# Altium schematic sheet PCB.SchDoc
size A4
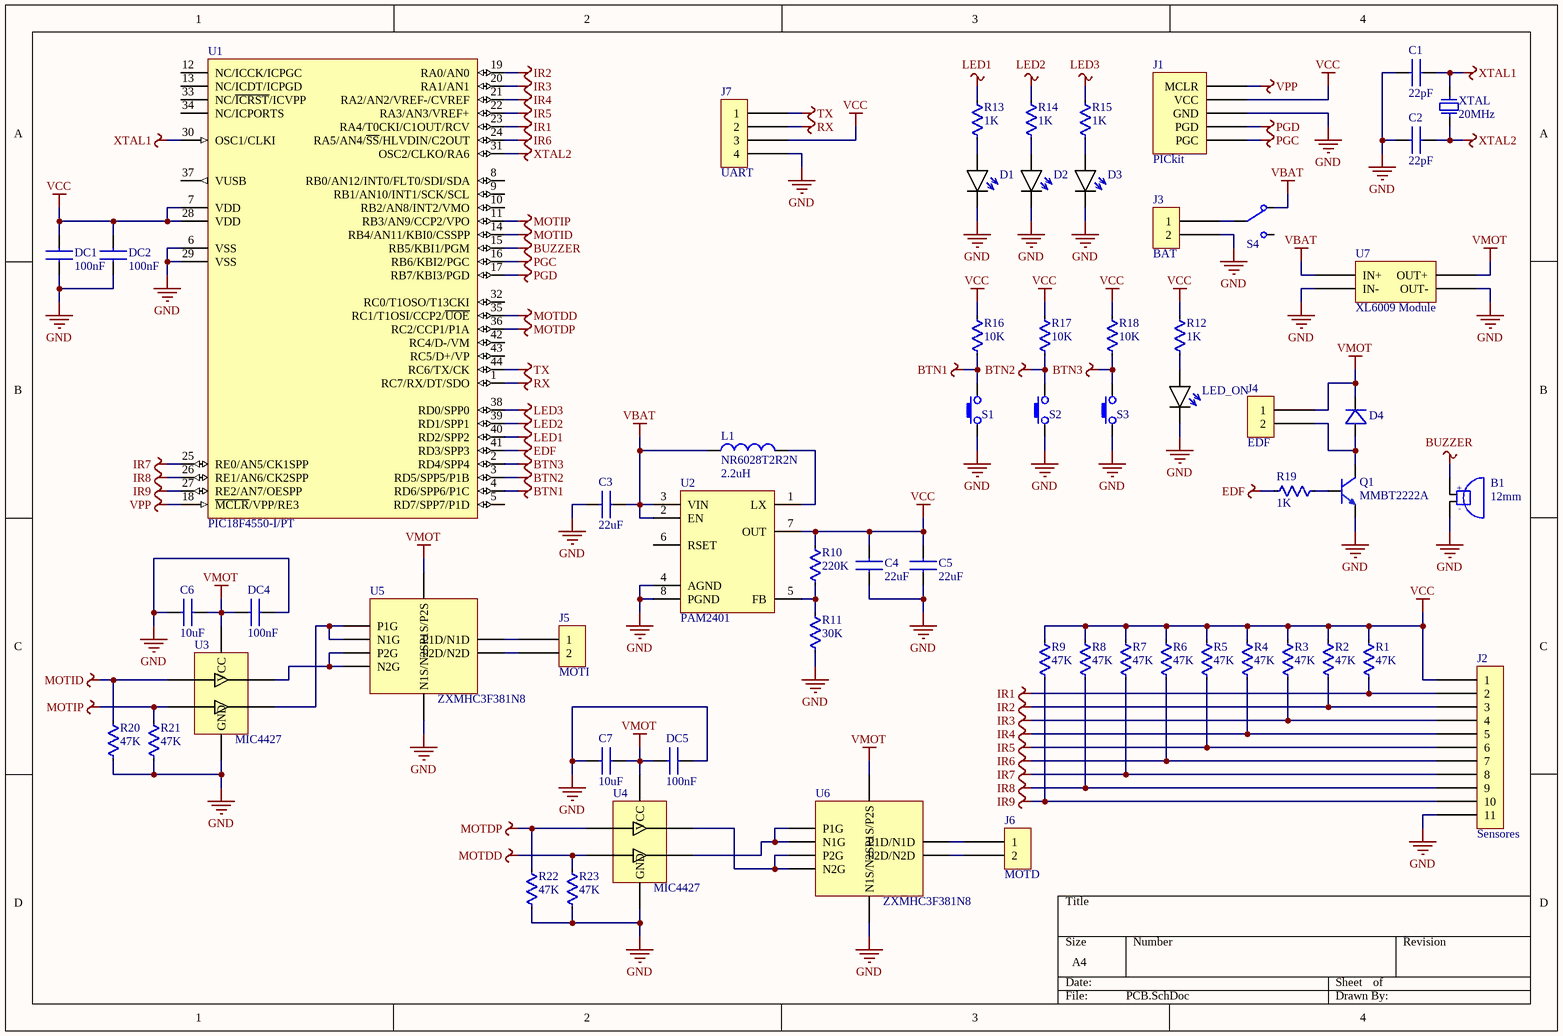
[diagram p0: PCB.SchDoc]

## Parts
B1  12mm  [BUZZER-12MM]
C1  value 22pF  [C1206]  (hidden comment: CAP-CER)
C2  value 22pF  [C1206]  (hidden comment: CAP-CER)
C3  value 22uF  [C1206]  (hidden comment: CAP-CER)
C4  value 22uF  [C1206]  (hidden comment: CAP-CER)
C5  value 22uF  [C1206]  (hidden comment: CAP-CER)
C6  value 10uF  [C1206]  (hidden comment: CAP-CER)
C7  value 10uF  [C1206]  (hidden comment: CAP-CER)
D1  LED  [LED-3MM-RED]  (value not drawn)
D2  LED  [LED-3MM-YELLOW]  (value not drawn)
D3  LED  [LED-3MM-GREEN]  (value not drawn)
D4  1N4007  [DO-214AC]  (value not drawn)
DC1  value 100nF  [C1206]  (hidden comment: CAP-CER)
DC2  value 100nF  [C1206]  (hidden comment: CAP-CER)
DC4  value 100nF  [C1206]  (hidden comment: CAP-CER)
DC5  value 100nF  [C1206]  (hidden comment: CAP-CER)
J1  PICkit  [Header 1x5]
J2  Sensores  [Header 1x11]
J3  BAT  [HEADER 1x2]
J4  EDF  [HEADER 1x2]
J5  MOTI  [HEADER 1x2]
J6  MOTD  [HEADER 1x2]
J7  UART  [Header 1x4]
L1  NR6028T2R2N  value 2.2uH  [NR6028]
LED_ON  LED  [LED-3MM-RED]  (value not drawn)
Q1  MMBT2222A  [SOT-23]
R1  value 47K  [R1206]  (hidden comment: RES)
R2  value 47K  [R1206]  (hidden comment: RES)
R3  value 47K  [R1206]  (hidden comment: RES)
R4  value 47K  [R1206]  (hidden comment: RES)
R5  value 47K  [R1206]  (hidden comment: RES)
R6  value 47K  [R1206]  (hidden comment: RES)
R7  value 47K  [R1206]  (hidden comment: RES)
R8  value 47K  [R1206]  (hidden comment: RES)
R9  value 47K  [R1206]  (hidden comment: RES)
R10  value 220K  [R1206]  (hidden comment: RES)
R11  value 30K  [R1206]  (hidden comment: RES)
R12  value 1K  [R1206]  (hidden comment: RES)
R13  value 1K  [R1206]  (hidden comment: RES)
R14  value 1K  [R1206]  (hidden comment: RES)
R15  value 1K  [R1206]  (hidden comment: RES)
R16  value 10K  [R1206]  (hidden comment: RES)
R17  value 10K  [R1206]  (hidden comment: RES)
R18  value 10K  [R1206]  (hidden comment: RES)
R19  value 1K  [R1206]  (hidden comment: RES)
R20  value 47K  [R1206]  (hidden comment: RES)
R21  value 47K  [R1206]  (hidden comment: RES)
R22  value 47K  [R1206]  (hidden comment: RES)
R23  value 47K  [R1206]  (hidden comment: RES)
S1  BUTTON  [TACT_SWITCH-SMALL-4PIN]  (value not drawn)
S2  BUTTON  [TACT_SWITCH-SMALL-4PIN]  (value not drawn)
S3  BUTTON  [TACT_SWITCH-SMALL-4PIN]  (value not drawn)
S4  SLIDE-SWITCH  [SWITCH]  (value not drawn)
U1  PIC18F4550-I/PT  [TQFP-PT44_L]
U2  PAM2401  [MSOP-8]
U3  MIC4427  [SOIC-8]
U4  MIC4427  [SOIC-8]
U5  ZXMHC3F381N8  [SOIC-8]
U6  ZXMHC3F381N8  [SOIC-8]
U7  XL6009 Module  [XL6009 mdl]
XTAL  FREQUENCY: 20MHz  [HC-49/S]  (hidden comment: XTAL)

## Nets
BTN1: R16.1 S1.2 U1.4(RD6/SPP6/P1C)
BTN2: R17.1 S2.2 U1.3(RD5/SPP5/P1B)
BTN3: R18.1 S3.2 U1.2(RD4/SPP4)
BUZZER: B1.1(+) U1.15(RB5/KBI1/PGM)
EDF: R19.1 U1.41(RD3/SPP3)
GND: B1.2(-) C1.1 C2.1 C3.1 C4.1 C5.1 C6.2 C7.2 D1.K D2.K D3.K DC1.1 DC2.1 DC4.2 DC5.2 J1.3(GND) J2.11 J3.2 J7.4 LED_ON.K Q1.E R11.1 R20.1 R21.1 R22.1 R23.1 S1.1 S2.1 S3.1 U1.6(VSS) U1.29(VSS) U2.4(AGND) U2.8(PGND) U3.3(GND) U4.3(GND) U5.3(N1S/N2S) U6.3(N1S/N2S) U7.1(IN-) U7.2(OUT-)
IR1: J2.2 R1.1 U1.23(RA4/T0CKI/C1OUT/RCV)
IR2: J2.3 R2.1 U1.19(RA0/AN0)
IR3: J2.4 R3.1 U1.20(RA1/AN1)
IR4: J2.5 R4.1 U1.21(RA2/AN2/VREF-/CVREF)
IR5: J2.6 R5.1 U1.22(RA3/AN3/VREF+)
IR6: J2.7 R6.1 U1.24(RA5/AN4/~{SS}/HLVDIN/C2OUT)
IR7: J2.8 R7.1 U1.25(RE0/AN5/CK1SPP)
IR8: J2.9 R8.1 U1.26(RE1/AN6/CK2SPP)
IR9: J2.10 R9.1 U1.27(RE2/AN7/OESPP)
LED1: R13.2 U1.40(RD2/SPP2)
LED2: R14.2 U1.39(RD1/SPP1)
LED3: R15.2 U1.38(RD0/SPP0)
MOTDD: R23.2 U1.35(RC1/T1OSI/CCP2/~{UOE}) U4.4(INB)
MOTDP: R22.2 U1.36(RC2/CCP1/P1A) U4.2(INA)
MOTID: R20.2 U1.14(RB4/AN11/KBI0/CSSPP) U3.2(INA)
MOTIP: R21.2 U1.11(RB3/AN9/CCP2/VPO) U3.4(INB)
PGC: J1.5(PGC) U1.16(RB6/KBI2/PGC)
PGD: J1.4(PGD) U1.17(RB7/KBI3/PGD)
RX: J7.2 U1.1(RC7/RX/DT/SDO)
TX: J7.1 U1.44(RC6/TX/CK)
VBAT: C3.2 L1.1 S4.1 U2.2(EN) U2.3(VIN) U7.0(IN+)
VCC: C4.2 C5.2 DC1.2 DC2.2 J1.2(VCC) J2.1 J7.3 R1.2 R2.2 R3.2 R4.2 R5.2 R6.2 R7.2 R8.2 R9.2 R10.2 R12.2 R16.2 R17.2 R18.2 U1.7(VDD) U1.28(VDD) U2.7(OUT)
VMOT: C6.1 C7.1 D4.K DC4.1 DC5.1 J4.1 U3.6(VCC) U4.6(VCC) U5.7(P1S/P2S) U6.7(P1S/P2S) U7.3(OUT+)
VPP: J1.1(MCLR) U1.18(~{MCLR}/VPP/RE3)
XTAL1: C1.2 U1.30(OSC1/CLKI) XTAL.2
XTAL2: C2.2 U1.31(OSC2/CLKO/RA6) XTAL.1
NetD1_A: D1.A R13.1
NetD2_A: D2.A R14.1
NetD3_A: D3.A R15.1
NetD4_A: D4.A J4.2 Q1.C
NetJ3_1: J3.1 S4.2
NetJ5_1: J5.1 U5.2(P1D/N1D)
NetJ5_2: J5.2 U5.6(P2D/N2D)
NetJ6_1: J6.1 U6.2(P1D/N1D)
NetJ6_2: J6.2 U6.6(P2D/N2D)
NetL1_2: L1.2 U2.1(LX)
NetLED_ON_A: LED_ON.A R12.1
NetQ1_B: Q1.B R19.2
NetR10_1: R10.1 R11.2 U2.5(FB)
NetU3_5: U3.5(OUTB) U5.1(N1G) U5.8(P1G)
NetU3_7: U3.7(OUTA) U5.4(N2G) U5.5(P2G)
NetU4_5: U4.5(OUTB) U6.1(N1G) U6.8(P1G)
NetU4_7: U4.7(OUTA) U6.4(N2G) U6.5(P2G)

Not connected (* = marked no-connect by the designer): S4 3; U1 5(RD7/SPP7/P1D) 8(RB0/AN12/INT0/FLT0/SDI/SDA) 9(RB1/AN10/INT1/SCK/SCL) 10(RB2/AN8/INT2/VMO) 12(NC/ICCK/ICPGC) 13(NC/ICDT/ICPGD) 32(RC0/T1OSO/T13CKI) 33(NC/~{ICRST}/ICVPP) 34(NC/ICPORTS) 37(VUSB) 42(RC4/D-/VM) 43(RC5/D+/VP); U2 6(RSET)

## Library data of the parts
B1 = BUZZER-ACTIVE
D4 = DIODE: NAME: 1N4007
J2 = Header 1x11
J3-J6 = Header 1x2
J7 = Header 1x4
L1 = INDUCTOR
Q1 = NPN
U1 = PIC18F4550-I/PT: High Performance, Enhanced Flash, USB Microcontroller with nanoWatt Technology, 32K Flash, 44-Pin TQFP, Industrial Temperature Range; Published: 29-Jan-2009; LatestRevisionDate: 02-Dec-2009; LatestRevisionNote: Updated to datasheet revision E, Aug-2008; DatasheetVersion: revE, Aug-2008; PackageVersion: revBB, Aug-2009; PackageReference: TQFP-PT44; Publisher: Altium Limited; PackageDescription: 44-Lead Plastic Thin Quad Flatpack (PT) - 10x10x1mm Body, 2.00mm [TQFP]; Supplier 1: Digi-Key; Supplier Part Number 1: PIC18F4550-I/PT-ND; Supplier 2: Farnell; Supplier Part Number 2: 9321365; Supplier 3: Farnell; Supplier Part Number 3: 1528447; Code_JEDEC: MS-026; ComponentLink1Description: Datasheet; ComponentLink1URL: http://ww1.microchip.com/downloads/en/DeviceDoc/39632e.pdf; ComponentLink2Description: Packaging Specification; ComponentLink2URL: http://www.microchip.com/stellent/groups/techpub_sg/documents/packagingspec/en012702.pdf; ComponentLink3Description: Microchip.com Home; ComponentLink3URL: http://www.microchip.com/
U3 U4 = 4427